# Altium schematic sheet main.SchDoc
size A; SheetNumber: 1; SheetTotal: 1
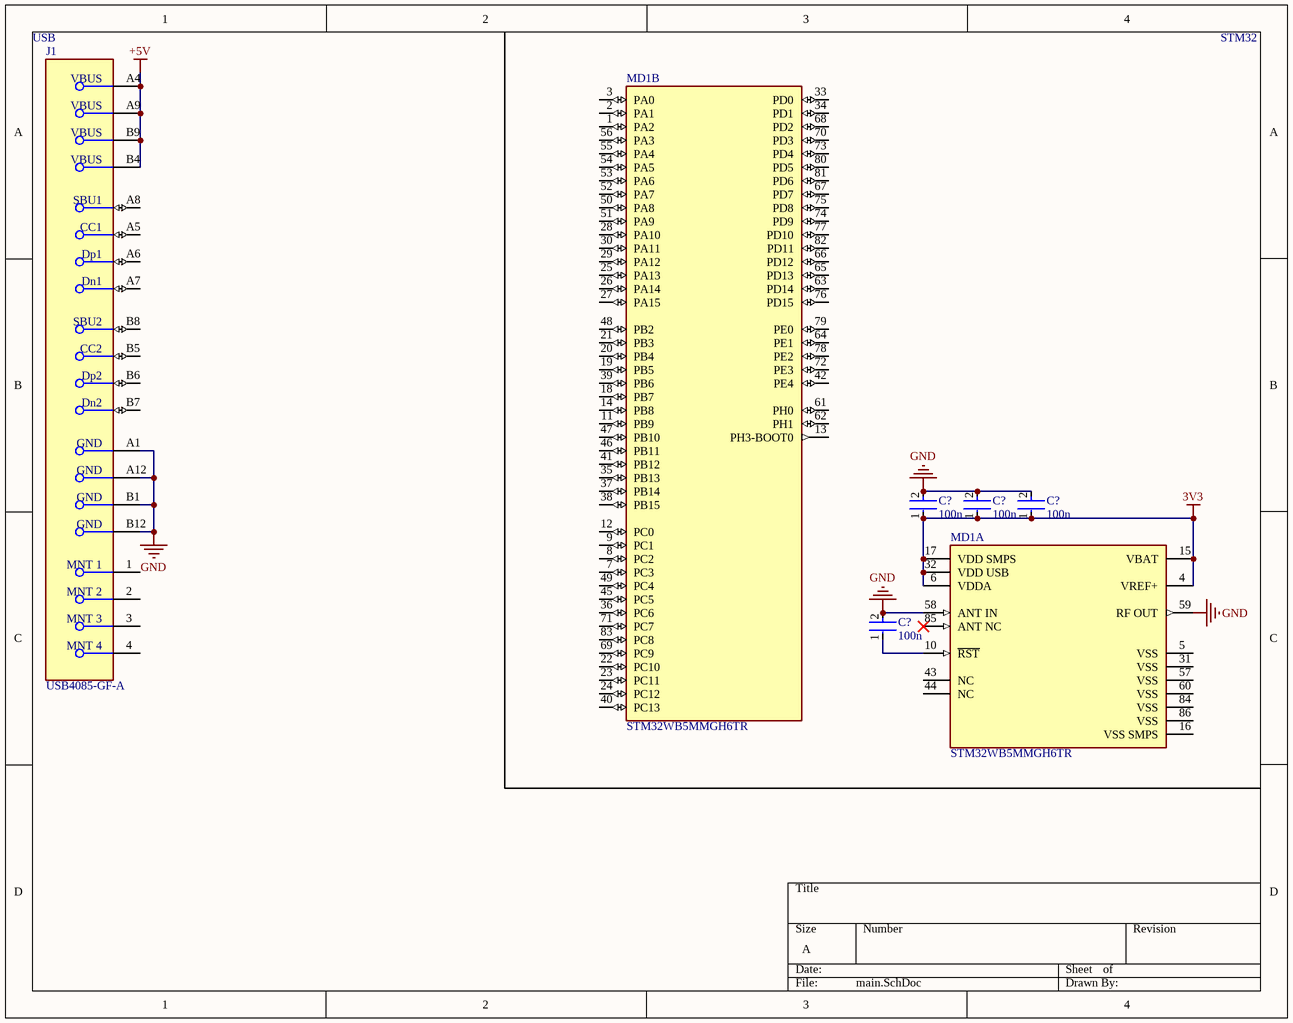
[diagram p0: main.SchDoc]

## Parts
(Parts that share a designator on the sheet are numbered #1, #2 ... from top to bottom, then left to right.)
C?#1  100n  [FP-GRM15-MFG]
C?#2  100n  [FP-GRM15-MFG]
C?#3  100n  [FP-GRM15-MFG]
C?#4  100n  [FP-GRM15-MFG]
J1  USB4085-GF-A  [FP-USB4085-GF-A-MFG]
MD1  STM32WB5MMGH6TR  [FP-STM32WB5MMGH6TR-MFG]  (parts A,B of 2)

## Nets
3V3: C?#1.1 C?#2.1 C?#3.1 MD1.4(VREF+) MD1.6(VDDA) MD1.15(VBAT) MD1.17(VDD_SMPS) MD1.32(VDD_USB)
+5V: J1.A4(VBUS) J1.A9(VBUS) J1.B4(VBUS) J1.B9(VBUS)
GND: C?#1.2 C?#2.2 C?#3.2 C?#4.2 J1.A1(GND) J1.A12(GND) J1.B1(GND) J1.B12(GND) MD1.58(ANT_IN) MD1.59(RF_OUT)
NetC?#4_1: C?#4.1 MD1.10(~{RST})

Not connected (* = marked no-connect by the designer): J1 1(MNT_1) 2(MNT_2) 3(MNT_3) 4(MNT_4) A5(CC1) A6(Dp1) A7(Dn1) A8(SBU1) B5(CC2) B6(Dp2) B7(Dn2) B8(SBU2); MD1 1(PA2) 2(PA1) 3(PA0) 5(VSS) 7(PC3) 8(PC2) 9(PC1) 11(PB9) 12(PC0) 13(PH3-BOOT0) 14(PB8) 16(VSS_SMPS) 18(PB7) 19(PB5) 20(PB4) 21(PB3) 22(PC10) 23(PC11) 24(PC12) 25(PA13) 26(PA14) 27(PA15) 28(PA10) 29(PA12) 30(PA11) 31(VSS) 33(PD0) 34(PD1) 35(PB13) 36(PC6) 37(PB14) 38(PB15) 39(PB6) 40(PC13) 41(PB12) 42(PE4) 43(NC) 44(NC) 45(PC5) 46(PB11) 47(PB10) 48(PB2) 49(PC4) 50(PA8) 51(PA9) 52(PA7) 53(PA6) 54(PA5) 55(PA4) 56(PA3) 57(VSS) 60(VSS) 61(PH0) 62(PH1) 63(PD14) 64(PE1) 65(PD13) 66(PD12) 67(PD7) 68(PD2) 69(PC9) 70(PD3) 71(PC7) 72(PE3) 73(PD4) 74(PD9) 75(PD8) 76(PD15) 77(PD10) 78(PE2) 79(PE0) 80(PD5) 81(PD6) 82(PD11) 83(PC8) 84(VSS) 85(ANT_NC)* 86(VSS)

## Notes on the sheet
- USB
- STM32

## Library data of the parts
C?#1-C?#4 = CMP-2100-03641-2: CAP CER 0.1UF 16V X7R 0402; Manufacturer Part Number: GRM155R71C104KA88D; Manufacturer: Murata; Standoff Height: 0mm; Tolerance: 10%; Description: CAP Ceramic 0.10μF 10% X7R 16Vdc 0402 SMD; Voltage Rating: 16Vdc; Material: Ceramic; Capacitance: 0.10μF; Value: 0.10μF; RoHS: TRUE; Temperature Characteristic: X7R; Octopart: https://octopart.com/grm155r71c104ka88d-murata-196880; Digikey Description: CAP CER 0.1UF 16V X7R 0402; Device Class L3: Ceramic Capacitors; Height: 0.55mm; ComponentLink2Description: Datasheet; Temperature Range Low: -55°C; Ipc Land Pattern Name: CAPC10050X219; ComponentLink2URL: https://search.murata.co.jp/Ceramy/image/img/A01X/G101/ENG/GRM155R71H471KA01-01A.pdf; Device Class L1: Passive Components; Lead Free: yes; Category: Cap; Package: GRM15; Temperature: -55°C to +125°C; Device Class L2: Capacitors; Temperature Range High: +125°C; Mouser Description: 0402 0.1 uF 16V ±10 % Tolerance X7R SMT Multilayer Ceramic Capacitor
J1 = CMP-196119-000001-2: CONN RCPT USB2.0 TYPE C 24POS RA; Gender: Receptacle; Number of Positions: 16; USB Standard: USB 2.0; Orientation: Right Angle; Contact Plating: Gold; Contact Material: Copper Alloy
MD1 = CMP-12160-000017-1: ULTRA-LOW-POWER DUAL CORE ARM CO